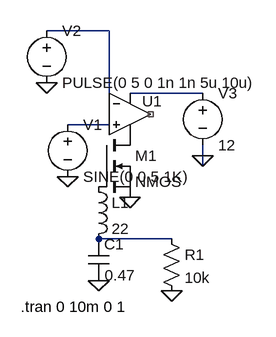
[diagram p0: schematic class D Amplifer.asc]
class D Amplifer.asc, the LTspice schematic file:
Version 4.1
SHEET 1 916 680
WIRE 464 32 368 32
WIRE 608 128 496 128
WIRE 464 144 464 32
WIRE 464 176 400 176
WIRE 608 224 608 208
WIRE 608 240 608 224
WIRE 560 352 448 352
FLAG 400 256 0
FLAG 368 112 0
FLAG 608 224 0
FLAG 496 288 0
FLAG 448 416 0
FLAG 560 432 0
SYMBOL voltage 400 160 R0
WINDOW 123 0 0 Left 0
WINDOW 39 0 0 Left 0
SYMATTR InstName V1
SYMATTR Value SINE(0 0.5 1K)
SYMBOL voltage 368 16 R0
WINDOW 123 0 0 Left 0
WINDOW 39 0 0 Left 0
SYMATTR InstName V2
SYMATTR Value PULSE(0 5 0 1n 1n 5u 10u)
SYMBOL OpAmps\\UniversalOpAmp2 496 160 R0
WINDOW 0 19 -20 Left 2
SYMATTR InstName U1
SYMBOL nmos 448 192 R0
SYMATTR InstName M1
SYMBOL ind 432 256 R0
SYMATTR InstName L1
SYMATTR Value 22
SYMBOL cap 432 352 R0
WINDOW 3 25 56 Left 2
SYMATTR InstName C1
SYMATTR Value 0.47
SYMBOL res 544 336 R0
SYMATTR InstName R1
SYMATTR Value 10k
SYMBOL voltage 608 112 R0
WINDOW 123 0 0 Left 0
WINDOW 39 0 0 Left 0
SYMATTR InstName V3
SYMATTR Value 12
TEXT 328 456 Left 2 !.tran 0 10m 0 1

The netlist it stands for:
* class D Amplifer.asc
V1 N003 0 SINE(0 0.5 1K)
V2 N001 0 PULSE(0 5 0 1n 1n 5u 10u)
X§U1 N003 N001 N002 P001 NC_01 level2 Avol=1Meg GBW=10Meg Slew=10Meg Ilimit=25m Rail=0 Vos=0 En=0 Enk=0 In=0 Ink=0 Rin=500Meg  ; pins In+ In- V+ V- OUT
M1 P001 P002 0 0 NMOS
L1 P002 N004 22
C1 N004 0 0.47
R1 N004 0 10k
V3 N002 0 12
.model NMOS NMOS
.model PMOS PMOS
.lib standard.mos
.tran 0 10m 0 1
.lib UniversalOpAmp2.lib
.backanno
.end